# EAGLE schematic fduino (EAGLE 9.3.1)
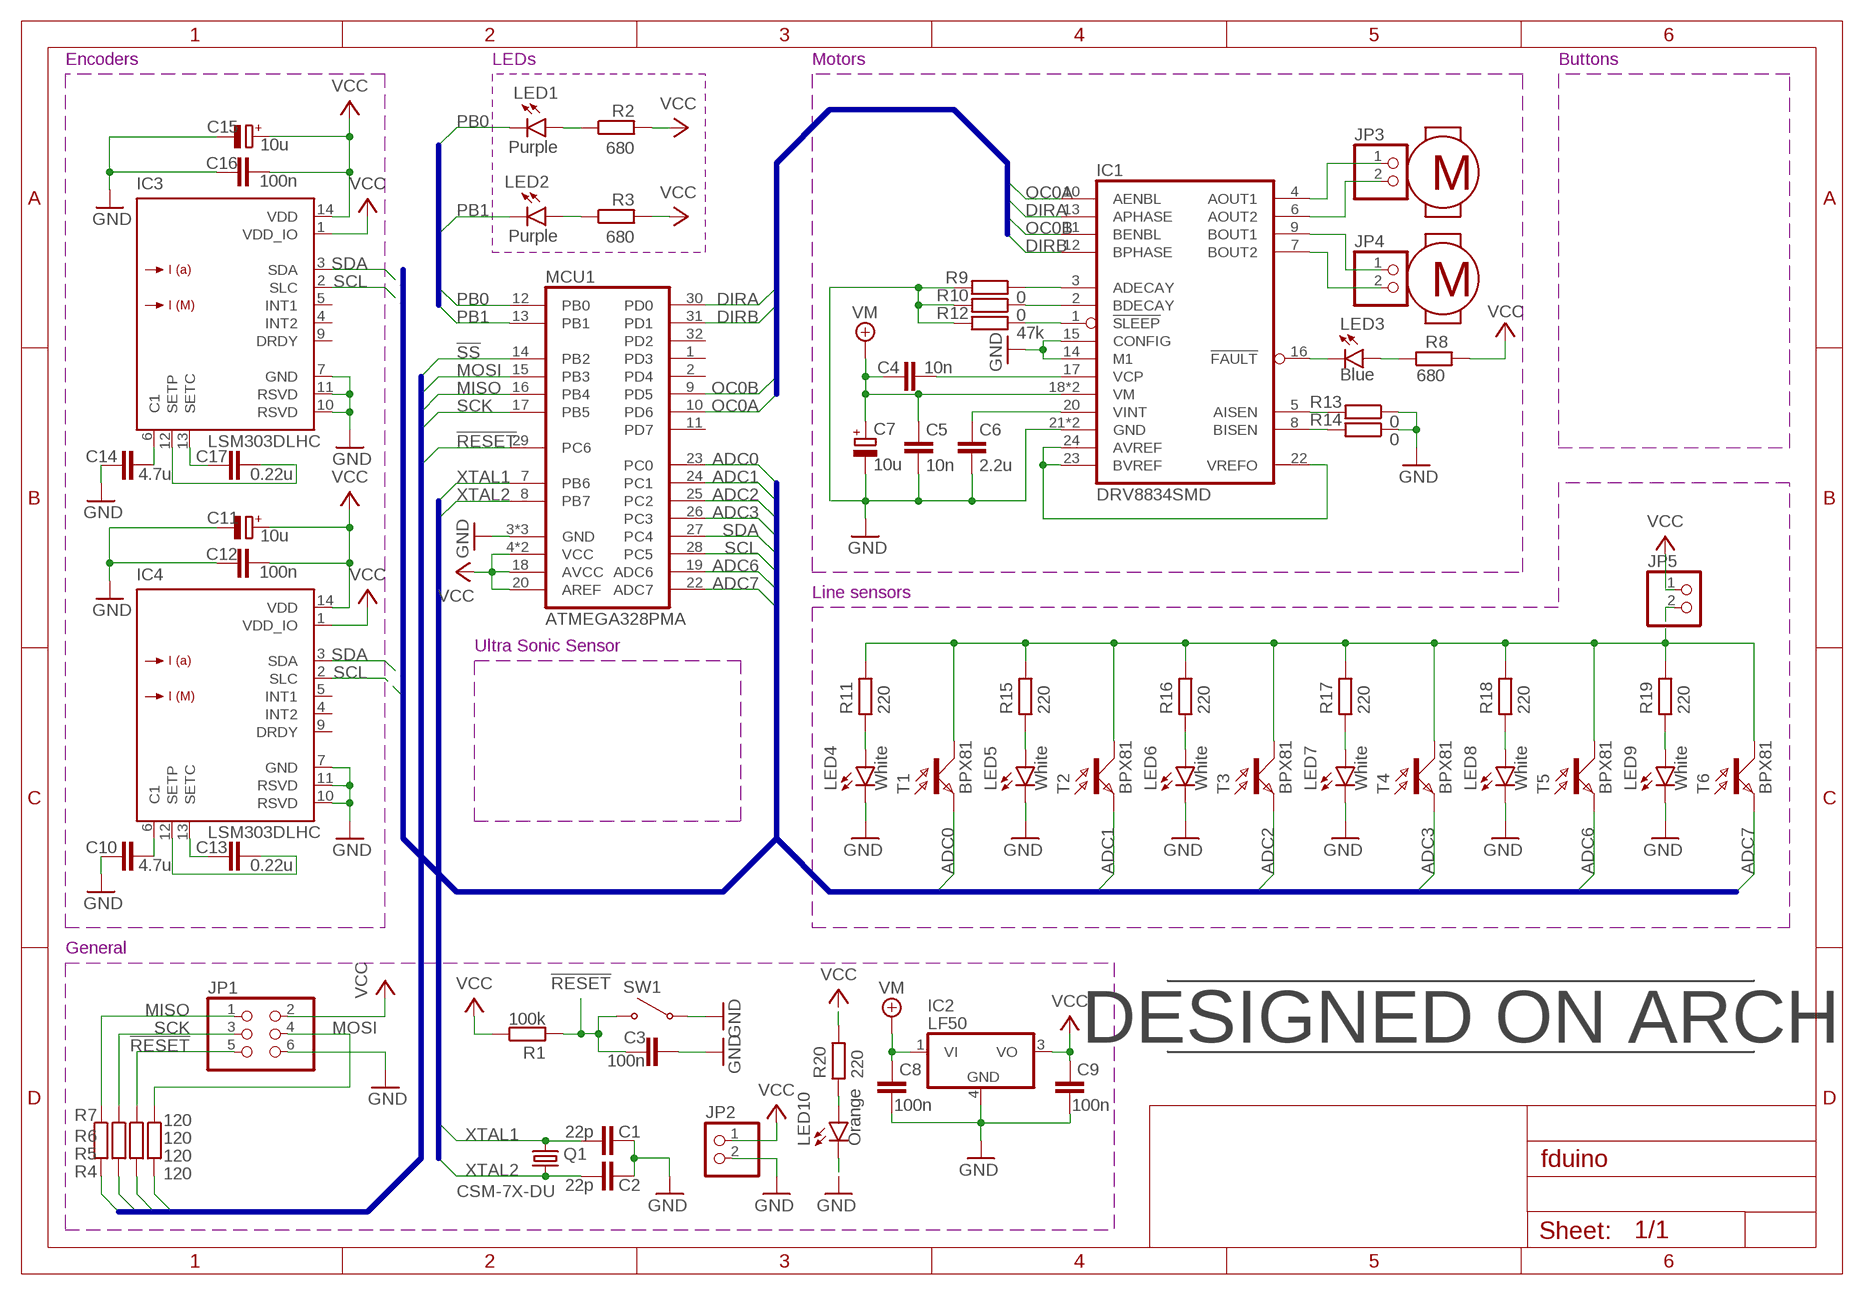
[diagram p0: schematic, sheet 1]

## Parts
C1  22p  C-EUC0603  [C0603]
C2  22p  C-EUC0603  [C0603]
C3  100n  C-EUC0603  [C0603]
C4  10n  C-EUC0603  [C0603]
C5  10n  C-EUC0603  [C0603]
C6  2.2u  C-EUC0603  [C0603]
C7  10u  CPOL-EUSMCZ  [SMC_Z]
C8  100n  C-EUC0603  [C0603]
C9  100n  C-EUC0603  [C0603]
C10  4.7u  C-EUC0603  [C0603]
C11  10u  CPOL-EUSMCZ  [SMC_Z]
C12  100n  C-EUC0603  [C0603]
C13  0.22u  C-EUC0603  [C0603]
C14  4.7u  C-EUC0603  [C0603]
C15  10u  CPOL-EUSMCZ  [SMC_Z]
C16  100n  C-EUC0603  [C0603]
C17  0.22u  C-EUC0603  [C0603]
IC1  DRV8834SMD  [HTSSOP]
IC2  LF50  LM340MP-05  [SOT223]
IC3  LSM303DLHC  [LGA-14]
IC4  LSM303DLHC  [LGA-14]
JP1  PINHD-2X3  [2X03]
JP2  PINHD-1X2  [1X02]
JP3  PINHD-1X2  [1X02]
JP4  PINHD-1X2  [1X02]
JP5  PINHD-1X2  [1X02]
LED1  Purple  LEDSML0603  [SML0603]
LED2  Purple  LEDSML0603  [SML0603]
LED3  Blue  LEDSML0603  [SML0603]
LED4  White  LEDSML0603  [SML0603]
LED5  White  LEDSML0603  [SML0603]
LED6  White  LEDSML0603  [SML0603]
LED7  White  LEDSML0603  [SML0603]
LED8  White  LEDSML0603  [SML0603]
LED9  White  LEDSML0603  [SML0603]
LED10  Orange  LEDSML0603  [SML0603]
MCU1  ATMEGA328PMA  [TQFP32]
Q1  CSM-7X-DU  [CSM-7X-DU]
R1  100k  R-EU_R0603  [R0603]
R2  680  R-EU_R0603  [R0603]
R3  680  R-EU_R0603  [R0603]
R4  120  R-EU_R0603  [R0603]
R5  120  R-EU_R0603  [R0603]
R6  120  R-EU_R0603  [R0603]
R7  120  R-EU_R0603  [R0603]
R8  680  R-EU_R0603  [R0603]
R9  0  R-EU_R0603  [R0603]
R10  0  R-EU_R0603  [R0603]
R11  220  R-EU_R0603  [R0603]
R12  47k  R-EU_R0603  [R0603]
R13  0  R-EU_R0603  [R0603]
R14  0  R-EU_R0603  [R0603]
R15  220  R-EU_R0603  [R0603]
R16  220  R-EU_R0603  [R0603]
R17  220  R-EU_R0603  [R0603]
R18  220  R-EU_R0603  [R0603]
R19  220  R-EU_R0603  [R0603]
R20  220  R-EU_R0603  [R0603]
SW1  SWITCHTHT  [SWITCH]
T1  BPX81  [BPX81]
T2  BPX81  [BPX81]
T3  BPX81  [BPX81]
T4  BPX81  [BPX81]
T5  BPX81  [BPX81]
T6  BPX81  [BPX81]

## Nets
!RESET: C3.1 JP1.5 MCU1.29(PC6) R1.2 R5.1 R5.2 SW1.P$2
!SS: MCU1.14(PB2)
ADC0: MCU1.23(PC0) T1.E
ADC1: MCU1.24(PC1) T2.E
ADC2: MCU1.25(PC2) T3.E
ADC3: MCU1.26(PC3) T4.E
ADC6: MCU1.19(ADC6) T5.E
ADC7: MCU1.22(ADC7) T6.E
DIRA: IC1.13(APHASE) MCU1.30(PD0)
DIRB: IC1.12(BPHASE) MCU1.31(PD1)
GND: C1.1 C2.1 C3.2 C5.2 C6.2 C7.- C8.2 C9.2 C10.2 C11.- C12.1 C14.2 C15.- C16.1 IC1.14(M1) IC1.15(CONFIG) IC1.21(GND) IC1.PPAD(GND) IC2.4(GND) IC3.7(GND) IC3.10(RSVD) IC3.11(RSVD) IC4.7(GND) IC4.10(RSVD) IC4.11(RSVD) JP1.6 JP2.2 LED4.C LED5.C LED6.C LED7.C LED8.C LED9.C LED10.C MCU1.3(GND) MCU1.5(GND) MCU1.21(GND) R13.1 R14.1 SW1.P$1
MISO: JP1.1 MCU1.16(PB4) R7.1 R7.2
MOSI: JP1.4 MCU1.15(PB3) R4.1 R4.2
N$1: C10.1 IC4.6(C1)
N$2: C13.2 IC4.12(SETP)
N$3: IC1.7(BOUT2) JP4.2
N$4: LED2.A R3.1
N$5: LED1.A R2.1
N$6: IC1.9(BOUT1) JP4.1
N$7: IC1.4(AOUT1) JP3.1
N$8: IC1.6(AOUT2) JP3.2
N$9: LED3.A R8.1
N$10: IC1.16(!FAULT) LED3.C
N$11: IC1.22(VREFO) IC1.23(BVREF) IC1.24(AVREF)
N$12: C13.1 IC4.13(SETC)
N$13: C14.1 IC3.6(C1)
N$14: C4.2 IC1.17(VCP)
N$15: C6.1 IC1.20(VINT)
N$16: IC1.3(ADECAY) R9.1
N$17: IC1.2(BDECAY) R10.1
N$18: IC1.1(!SLEEP) R12.1
N$19: IC1.5(AISEN) R13.2
N$20: R9.2 R10.2 R12.2
N$21: IC1.8(BISEN) R14.2
N$22: LED4.A R11.2
N$23: LED5.A R15.2
N$24: R15.1
N$26: JP5.2 T1.C T2.C T3.C T4.C T5.C T6.C
N$27: LED6.A R16.2
N$28: R16.1
N$29: C17.2 IC3.12(SETP)
N$30: C17.1 IC3.13(SETC)
N$31: LED7.A R17.2
N$32: R11.1
N$33: JP5.1
N$35: R17.1
N$36: LED10.A R20.2
N$37: LED8.A R18.2
N$38: R18.1
N$40: LED9.A R19.2
N$41: R19.1
OC0A: IC1.10(AENBL) MCU1.10(PD6)
OC0B: IC1.11(BENBL) MCU1.9(PD5)
PB0: LED1.C MCU1.12(PB0)
PB1: LED2.C MCU1.13(PB1)
SCK: JP1.3 MCU1.17(PB5) R6.1 R6.2
SCL: IC3.2(SLC) IC4.2(SLC) MCU1.28(PC5)
SDA: IC3.3(SDA) IC4.3(SDA) MCU1.27(PC4)
VCC: C9.1 C11.+ C12.2 C15.+ C16.2 IC2.3(VO) IC3.1(VDD_IO) IC3.14(VDD) IC4.1(VDD_IO) IC4.14(VDD) JP1.2 JP2.1 MCU1.4(VCC) MCU1.6(VCC) MCU1.18(AVCC) MCU1.20(AREF) R1.1 R2.2 R3.2 R8.2 R20.1
VM: C4.1 C5.1 C7.+ C8.1 IC1.18(VM) IC1.19(VM) IC2.1(VI)
XTAL1: C1.2 MCU1.7(PB6) Q1.2
XTAL2: C2.2 MCU1.8(PB7) Q1.1
Unconnected: IC3.4(INT2) IC3.5(INT1) IC3.9(DRDY) IC4.4(INT2) IC4.5(INT1) IC4.9(DRDY) MCU1.1(PD3) MCU1.2(PD4) MCU1.11(PD7) MCU1.32(PD2)

## Buses
XTAL1,XTAL2
MISO,MOSI,!RESET,SCK,!SS
DIRA,DIRB,OC0A,OC0B
ADC0,ADC1,ADC2,ADC3,ADC6,ADC7,SCL,SDA
PB0,PB1
SCL,SDA

## Notes on the sheet
- Encoders | LEDs | Motors | Buttons
- Line sensors
- Ultra Sonic Sensor
- General
- DESIGNED ON ARCH

## Library data of the parts
C1-C6 C8-C10 C12-C14 C16 C17 = rcl:C-EU: CAPACITOR, European symbol; SPICEPREFIX: C
C7 C11 C15 = rcl:CPOL-EU: POLARIZED CAPACITOR, European symbol; SPICEPREFIX: C
IC1 = martinmake:DRV8834: The DRV8834 supports two configurations: phase/enable mode, where the outputs are controlled by phase (direction) and enable signals for each H-bridge, and indexer mode, which allow control of a stepper motor using simple step and direction inputs.
IC2 = linear:LM340?-*: Positive VOLTAGE REGULATOR Source: http://cache.national.com/ds/LM/LM340.pdf
IC3 IC4 = st-microelectronics:LSM303DLHC: Ultra compact high performance e-compass, 3D accelerometer and 3D magnetometer module Source: DM00027543-118326.pdf
JP1 = pinhead:PINHD-2X3: PIN HEADER
JP2-JP5 = pinhead:PINHD-1X2: PIN HEADER
LED1-LED10 = led:LED: LED OSRAM: - CHIPLED LG R971, LG N971, LY N971, LG Q971, LY Q971, LO R971, LY R971 LH N974, LH R974 LS Q976, LO Q976, LY Q976 LO Q996 - Hyper CHIPLED LW Q18S LB Q993, LB Q99A, LB R99A - SideLED LS A670, LO A670, LY A670, LG A670, LP A670 LB A673, LV A673, LT A673, LW A673 LH A674 LY A675 LS A676, LA A676, LO A676, LY A676, LW A676 LS A679, LY A679, LG A679 - Hyper Micro SIDELED® LS Y876, LA Y876, LO Y876, LY Y876 LT Y87S - SmartLED LW L88C, LW L88S LB L89C, LB L89S, LG L890 LS L89K, LO L89K, LY L89K LS L896, LA L896, LO L896, LY L896 - TOPLED LS T670, LO T670, LY T670, LG T670, LP T670 LSG T670, LSP T670, LSY T670, LOP T670, LYG T670 LG T671, LOG T671, LSG T671 LB T673, LV T673, LT T673, LW T673 LH T674 LS T676, LA T676, LO T676, LY T676, LB T676, LH T676, LSB T676, LW T676 LB T67C, LV T67C, LT T67C, LS T67K, LO T67K, LY T67K, LW E67C LS E67B, LA E67B, LO E67B, LY E67B, LB E67C, LV E67C, LT E67C LW T67C LS T679, LY T679, LG T679 LS T770, LO T770, LY T770, LG T770, LP T770 LB T773, LV T773, LT T773, LW T773 LH T774 LS E675, LA E675, LY E675, LS T675 LS T776, LA T776, LO T776, LY T776, LB T776 LHGB T686 LT T68C, LB T68C - Hyper Mini TOPLED® LB M676 - Mini TOPLED Santana® LG M470 LS M47K, LO M47K, LY M47K Source: http://www.osram.convergy.de LUXEON: - LUMILED® LXK2-PW12-R00, LXK2-PW12-S00, LXK2-PW14-U00, LXK2-PW14-V00 LXK2-PM12-R00, LXK2-PM12-S00, LXK2-PM14-U00 LXK2-PE12-Q00, LXK2-PE12-R00, LXK2-PE12-S00, LXK2-PE14-T00, LXK2-PE14-U00 LXK2-PB12-K00, LXK2-PB12-L00, LXK2-PB12-M00, LXK2-PB14-N00, LXK2-PB14-P00, LXK2-PB14-Q00 LXK2-PR12-L00, LXK2-PR12-M00, LXK2-PR14-Q00, LXK2-PR14-R00 LXK2-PD12-Q00, LXK2-PD12-R00, LXK2-PD12-S00 LXK2-PH12-R00, LXK2-PH12-S00 LXK2-PL12-P00, LXK2-PL12-Q00, LXK2-PL12-R00 Source: www.luxeon.com KINGBRIGHT: KA-3528ASYC Source: www.kingbright.com
MCU1 = martinmake:ATMEGA328P: 32A, 32-lead, 7 x 7 mm Body Size, 1.0 mm Body Thickness, 0.8 mm Lead Pitch, Thin Profile Plastic Quad Flat Package (TQFP)
Q1 = crystal:CSM-7X-DU: SMD CRYSTAL Source: www.ecsxtal.com .. Crystal 3.6864MHz CSM_7X_DU.PDF; OC_FARNELL: unknown; OC_NEWARK: unknown
R1-R20 = rcl:R-EU_: RESISTOR, European symbol; SPICEPREFIX: R
SW1 = martinmake:SWITCH
T1-T6 = opto-trans-siemens:BPX81: PHOTO TRANSISTOR; OC_FARNELL: unknown; OC_NEWARK: unknown